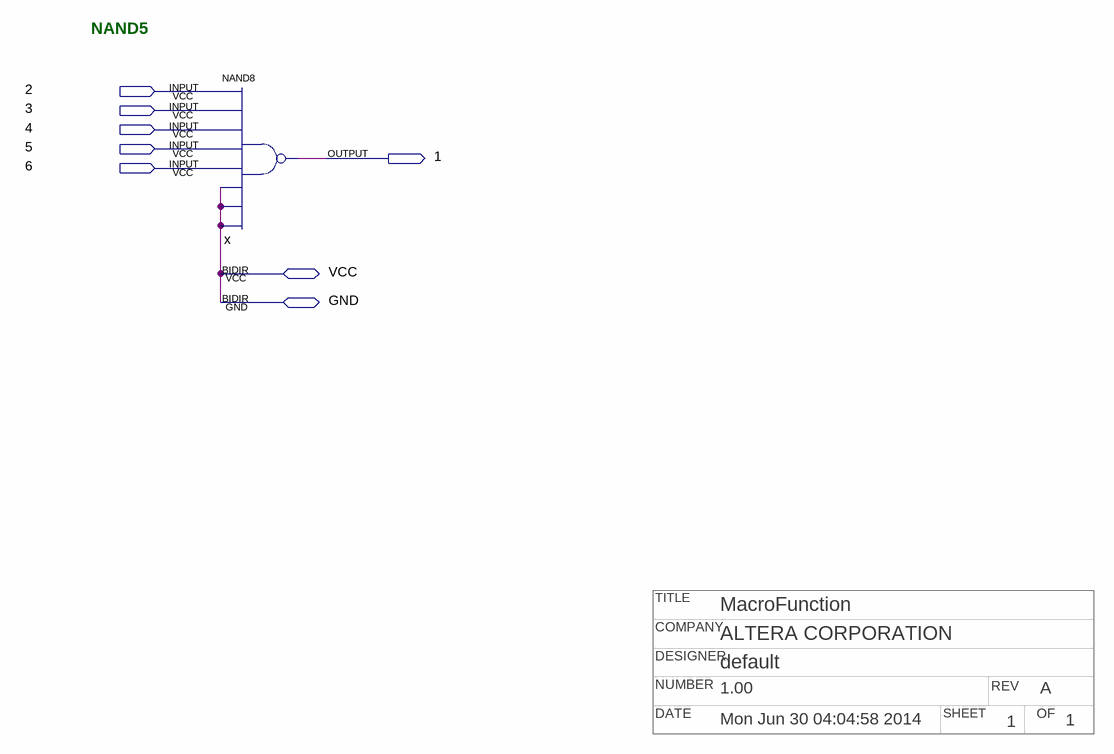
[diagram p0: schematic sheet]
// Quartus schematic npnand5.bdf as structural Verilog: 1 symbols, 8 pins
// Title block: TITLE: MacroFunction; COMPANY: ALTERA CORPORATION; DESIGNER: default; NUMBER: 1.00; REV: A; DATE: Mon Jun 30 04:04:58 2014; SHEET: 1; OF: 1
module npnand5 (
  input  \2 ,
  input  \3 ,
  input  \4 ,
  input  \5 ,
  input  \6 ,
  inout  VCC,
  inout  GND,
  output \1 
);

  nand x (\1 , \2 , \3 , \4 , \5 , \6 , GND, GND, GND);

  assign VCC = GND;

  // Notes on the sheet:
  //   NAND5
endmodule
